# EAGLE design arduino_motor_shield2 (EAGLE 5.07)
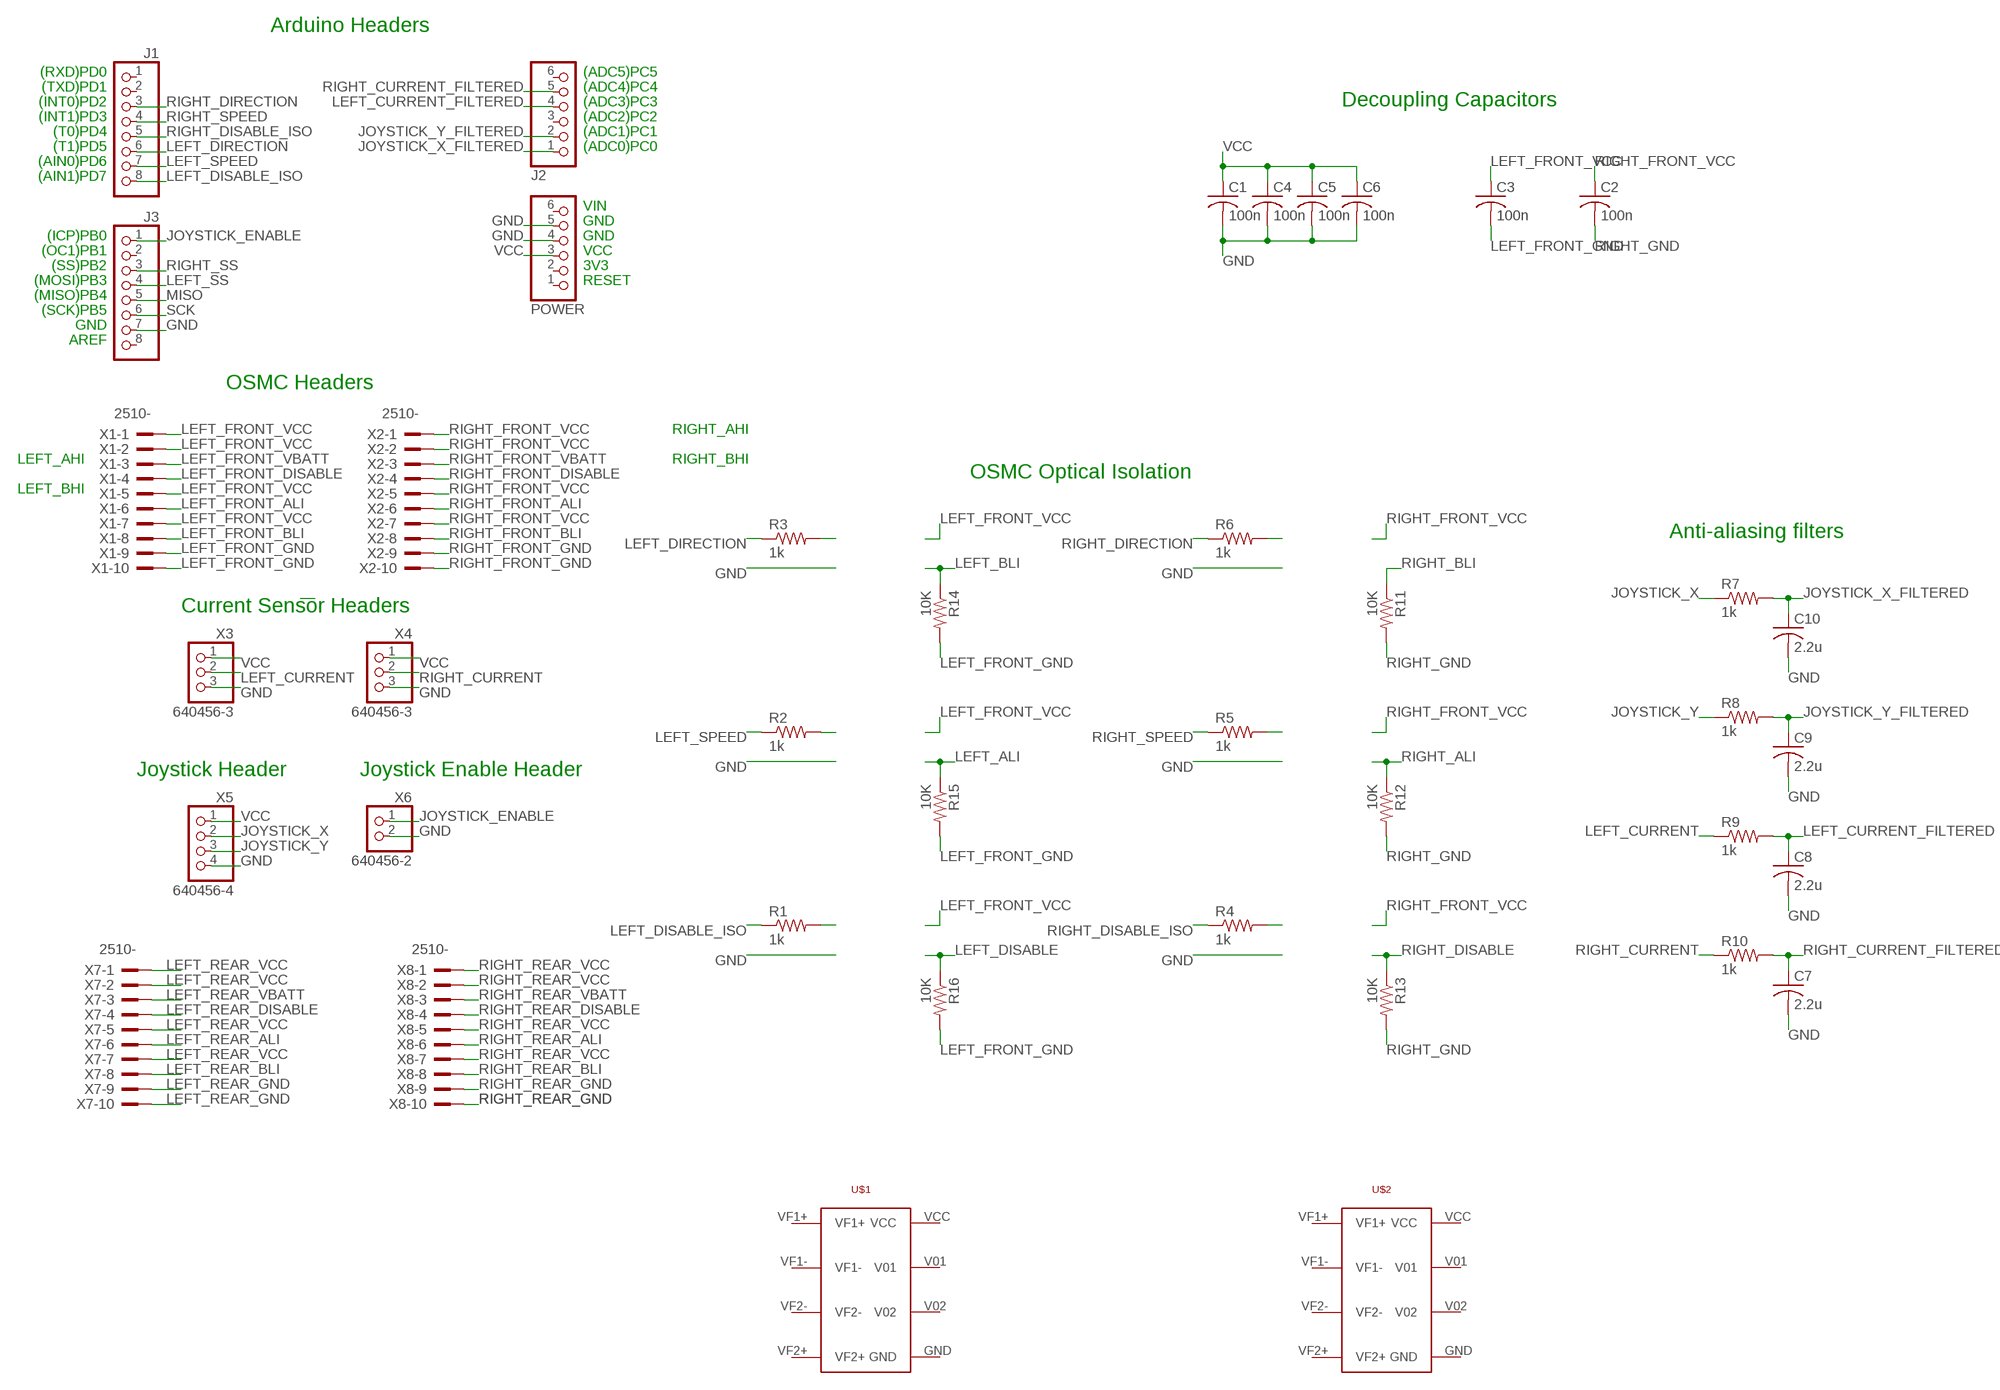
[diagram p0: schematic, sheet 1]

## Parts
C1  100n  C-USC0603  [C0603]
C2  100n  C-USC0603  [C0603]
C3  100n  C-USC0603  [C0603]
C4  100n  C-USC0603  [C0603]
C5  100n  C-USC0603  [C0603]
C6  100n  C-USC0603  [C0603]
C7  2.2u  C-USC0603  [C0603]
C8  2.2u  C-USC0603  [C0603]
C9  2.2u  C-USC0603  [C0603]
C10  2.2u  C-USC0603  [C0603]
J1  PINHD-1X8  [1X08]
J2  PINHD-1X6  [1X06]
J3  PINHD-1X8  [1X08]
POWER  PINHD-1X6  [1X06]
R1  1k  R-US_R0603  [R0603]
R2  1k  R-US_R0603  [R0603]
R3  1k  R-US_R0603  [R0603]
R4  1k  R-US_R0603  [R0603]
R5  1k  R-US_R0603  [R0603]
R6  1k  R-US_R0603  [R0603]
R7  1k  R-US_R0603  [R0603]
R8  1k  R-US_R0603  [R0603]
R9  1k  R-US_R0603  [R0603]
R10  1k  R-US_R0603  [R0603]
R11  10K  R-US_R0603  [R0603]
R12  10K  R-US_R0603  [R0603]
R13  10K  R-US_R0603  [R0603]
R14  10K  R-US_R0603  [R0603]
R15  10K  R-US_R0603  [R0603]
R16  10K  R-US_R0603  [R0603]
U$1  HCPL0611  [HCPL0611]
U$2  HCPL0611  [HCPL0611]
X1  2510-  [PAK100/2500-10]
X2  2510-  [PAK100/2500-10]
X3  640456-3  [22-23-2031]
X4  640456-3  [22-23-2031]
X5  640456-4  [22-23-2041]
X6  640456-2  [22-23-2021]
X7  2510-  [PAK100/2500-10]
X8  2510-  [PAK100/2500-10]

## Nets
GND: C1.2 C4.2 C5.2 C6.2 C7.2 C8.2 C9.2 C10.2 J3.7 POWER.4 POWER.5 X3.3 X4.3 X5.4 X6.2
JOYSTICK_ENABLE: J3.1 X6.1
JOYSTICK_X: R7.1 X5.2
JOYSTICK_X_FILTERED: C10.1 J2.1 R7.2
JOYSTICK_Y: R8.1 X5.3
JOYSTICK_Y_FILTERED: C9.1 J2.2 R8.2
LEFT_ALI: R15.1
LEFT_BLI: R14.1
LEFT_CURRENT: R9.1 X3.2
LEFT_CURRENT_FILTERED: C8.1 J2.4 R9.2
LEFT_DIRECTION: J1.6 R3.1
LEFT_DISABLE: R16.1
LEFT_DISABLE_ISO: J1.8 R1.1
LEFT_FRONT_ALI: X1.6
LEFT_FRONT_BLI: X1.8
LEFT_FRONT_DISABLE: X1.4
LEFT_FRONT_GND: C3.2 R14.2 R15.2 R16.2 X1.9 X1.10
LEFT_FRONT_VBATT: X1.3
LEFT_FRONT_VCC: C3.1 X1.1 X1.2 X1.5 X1.7
LEFT_REAR_ALI: X7.6
LEFT_REAR_BLI: X7.8
LEFT_REAR_DISABLE: X7.4
LEFT_REAR_GND: X7.9 X7.10
LEFT_REAR_VBATT: X7.3
LEFT_REAR_VCC: X7.1 X7.2 X7.5 X7.7
LEFT_SPEED: J1.7 R2.1
LEFT_SS: J3.4
MISO: J3.5
N$3: R2.2
N$8: R3.2
N$11: R6.2
N$14: R4.2
N$17: R1.2
N$20: R5.2
RIGHT_ALI: R12.1
RIGHT_BLI: R11.1
RIGHT_CURRENT: R10.1 X4.2
RIGHT_CURRENT_FILTERED: C7.1 J2.5 R10.2
RIGHT_DIRECTION: J1.3 R6.1
RIGHT_DISABLE: R13.1
RIGHT_DISABLE_ISO: J1.5 R4.1
RIGHT_FRONT_ALI: X2.6
RIGHT_FRONT_BLI: X2.8
RIGHT_FRONT_DISABLE: X2.4
RIGHT_FRONT_GND: X2.9 X2.10
RIGHT_FRONT_VBATT: X2.3
RIGHT_FRONT_VCC: C2.1 X2.1 X2.2 X2.5 X2.7
RIGHT_GND: C2.2 R11.2 R12.2 R13.2
RIGHT_REAR_ALI: X8.6
RIGHT_REAR_BLI: X8.8
RIGHT_REAR_DISABLE: X8.4
RIGHT_REAR_GND: X8.9 X8.10
RIGHT_REAR_VBATT: X8.3
RIGHT_REAR_VCC: X8.1 X8.2 X8.5 X8.7
RIGHT_SPEED: J1.4 R5.1
RIGHT_SS: J3.3
SCK: J3.6
VCC: C1.1 C4.1 C5.1 C6.1 POWER.3 X3.1 X4.1 X5.1
Unconnected: J1.1 J1.2 J2.3 J2.6 J3.2 J3.8 POWER.1 POWER.2 POWER.6 U$1.GND U$1.V01 U$1.V02 U$1.VCC U$1.VF1+ U$1.VF1- U$1.VF2+ U$1.VF2- U$2.GND U$2.V01 U$2.V02 U$2.VCC U$2.VF1+ U$2.VF1- U$2.VF2+ U$2.VF2-

## Notes on the sheet
- Arduino Headers
- (RXD)PD0 | (ADC5)PC5
- (TXD)PD1 | (ADC4)PC4
- (INT0)PD2 | (ADC3)PC3 | Decoupling Capacitors
- (INT1)PD3 | (ADC2)PC2
- (T0)PD4 | (ADC1)PC1
- (T1)PD5 | (ADC0)PC0
- (AIN0)PD6
- (AIN1)PD7
- VIN
- GND
- (ICP)PB0 | GND
- (OC1)PB1 | VCC
- (SS)PB2 | 3V3
- (MOSI)PB3 | RESET
- (MISO)PB4
- (SCK)PB5
- GND
- AREF
- OSMC Headers
- RIGHT_AHI
- LEFT_AHI | RIGHT_BHI
- OSMC Optical Isolation
- LEFT_BHI
- Anti-aliasing filters
- Current Sensor Headers
- Joystick Header | Joystick Enable Header

## Library data of the parts
C1-C10 = rcl:C-US: CAPACITOR, American symbol
J1 J3 = pinhead:PINHD-1X8: PIN HEADER
J2 POWER = pinhead:PINHD-1X6: PIN HEADER
R1-R16 = rcl:R-US_: RESISTOR, American symbol
U$1 U$2 = HCPL0611:HCPL0611
X1 X2 X7 X8 = con-3m:2510-: 3M (TM) Pak 100 4-Wall Header Source: 3M
X3 X4 = con-tycoelectronics:640456-3
X5 = con-tycoelectronics:640456-4
X6 = con-tycoelectronics:640456-2

## Board
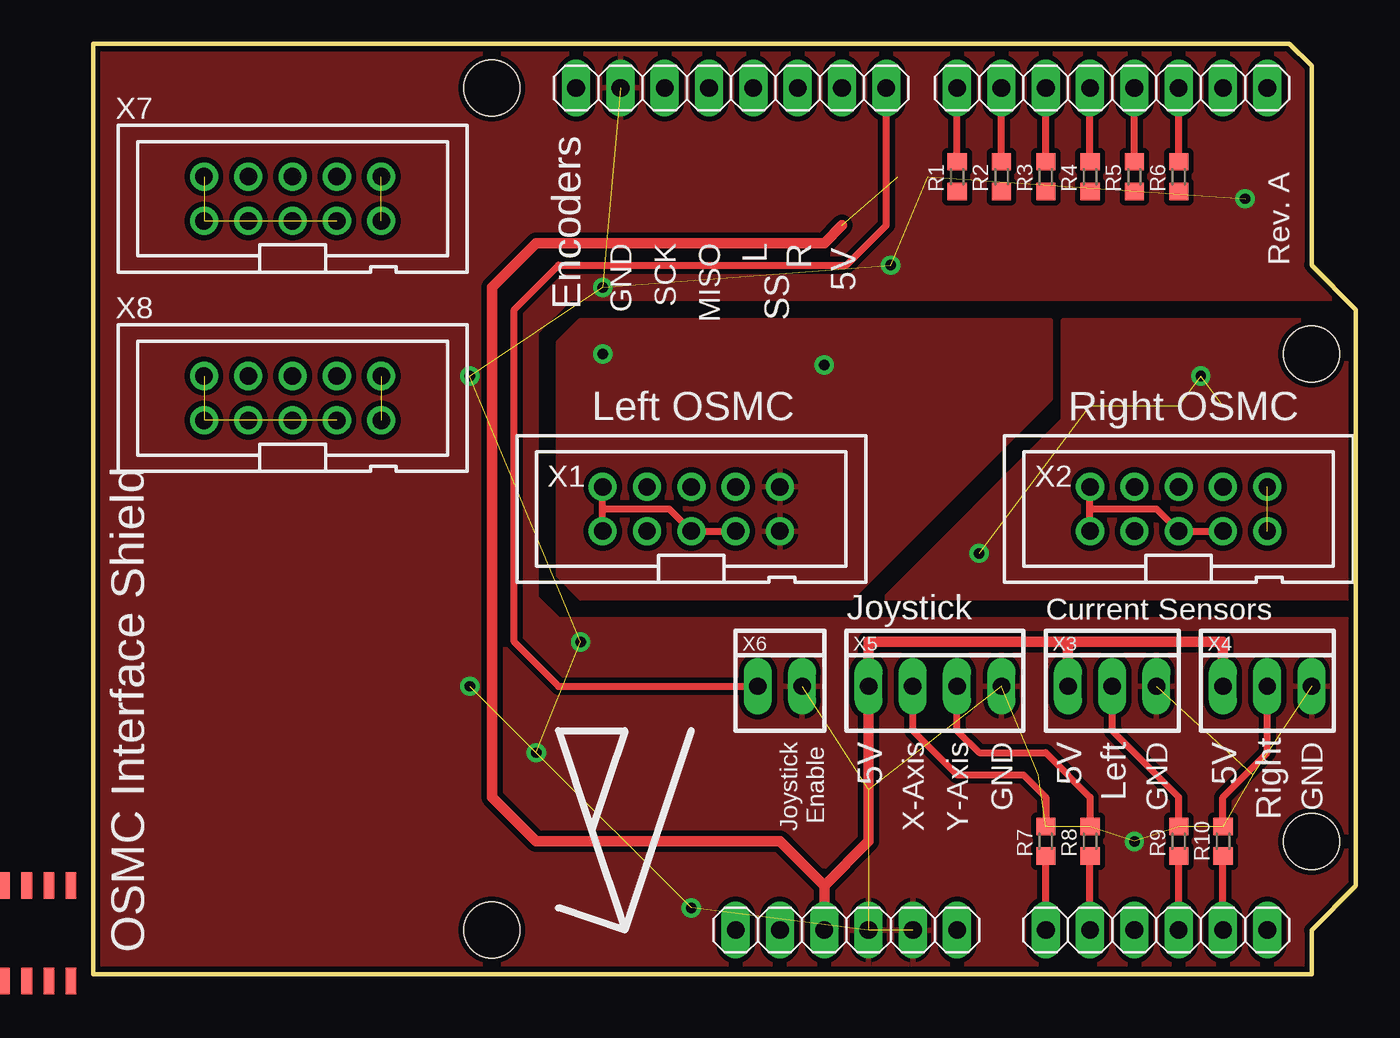
[diagram p1: board, top side]
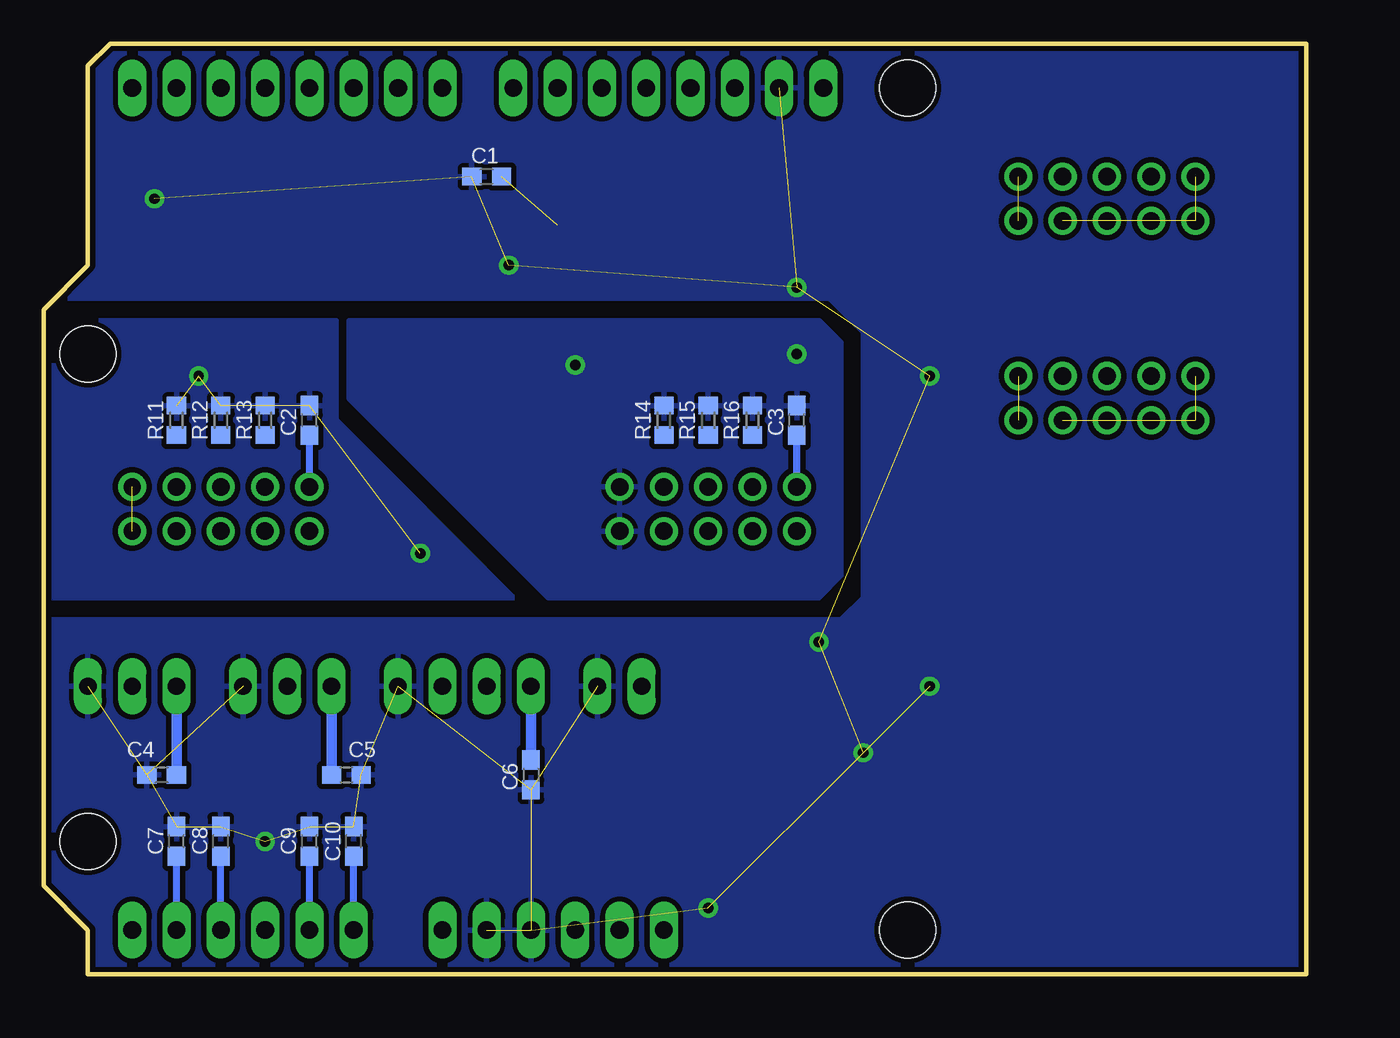
[diagram p2: board, bottom side, seen from below]

Size 72.39 x 53.34 mm. Coordinates in mm from the lower left corner, seen from the top.
Outline: 0,53.34 68.58,53.34 69.85,52.07 69.85,40.64 72.39,38.1 72.39,5.08 69.85,2.54 69.85,0 0,0 0,53.34
Copper layers (1*16): Top 0.035mm / dielectric 1.5mm / Bottom 0.035mm
Design rules "SparkFun": minimum track width 8mil, minimum drill 20mil, track to track 8mil, track to pad 8mil, pad to pad 8mil, via to via 8mil, smd to smd 8mil, copper to edge 10mil, drill to drill 8mil, minimum pad ring 12mil, minimum via ring 10mil, stop-mask expansion 4mil, vias tented up to drill 25mil, thermal gap 10mil
Holes 3.2 mm at 69.85,35.56 69.85,7.62 22.86,50.8 22.86,2.54

### Footprints (pad centres in the part's own frame; a part is rotated, then mirrored left to right if it is on the bottom)
C0603 = smd 1.1 x 1: 1 -0.85,0; 2 0.85,0
1X08 = drill 1.016 long: 1 -8.89,0; 2 -6.35,0; 3 -3.81,0; 4 -1.27,0; 5 1.27,0; 6 3.81,0; 7 6.35,0; 8 8.89,0
1X06 = drill 1.016 long: 1 -6.35,0; 2 -3.81,0; 3 -1.27,0; 4 1.27,0; 5 3.81,0; 6 6.35,0
R0603 = smd 1 x 1.1: 1 -0.85,0; 2 0.85,0
HCPL0611 = smd 0.61 x 1.524: GND 0,-5.461; V01 2.54,-5.461; V02 1.27,-5.461; VCC 3.81,-5.461; VF1+ 3.81,0; VF1- 2.54,0; VF2+ 0,0; VF2- 1.27,0
PAK100/2500-10 = drill 1 pad 1.422 round: 1 -5.08,-1.27; 2 -5.08,1.27; 3 -2.54,-1.27; 4 -2.54,1.27; 5 0,-1.27; 6 0,1.27; 7 2.54,-1.27; 8 2.54,1.27; 9 5.08,-1.27; 10 5.08,1.27
22-23-2031 = drill 1 long: 1 -2.54,0; 2 0,0; 3 2.54,0
22-23-2041 = drill 1 long: 1 -3.81,0; 2 -1.27,0; 3 1.27,0; 4 3.81,0
22-23-2021 = drill 1 long: 1 -1.27,0; 2 1.27,0

### Placement (x,y rotation side)
C1  46.99,45.72 180 bottom
C2  57.15,31.75 90 bottom
C3  29.21,31.75 90 bottom
C4  65.62,11.43 180 bottom
C5  55.03,11.43 0 bottom
C6  44.45,11.43 270 bottom
C7  64.77,7.62 90 bottom
C8  62.23,7.62 90 bottom
C9  57.15,7.62 90 bottom
C10  54.61,7.62 90 bottom
J1  58.42,50.8 180 top
J2  60.96,2.54 0 top
J3  36.58,50.8 180 top
POWER  43.18,2.54 0 top
R1  49.53,45.72 270 top
R2  52.07,45.72 270 top
R3  54.61,45.72 270 top
R4  57.15,45.72 270 top
R5  59.69,45.72 270 top
R6  62.23,45.72 270 top
R7  54.61,7.62 270 top
R8  57.15,7.62 270 top
R9  62.23,7.62 270 top
R10  64.77,7.62 270 top
R11  64.77,31.75 90 bottom
R12  62.23,31.75 90 bottom
R13  59.69,31.75 90 bottom
R14  36.83,31.75 90 bottom
R15  34.29,31.75 90 bottom
R16  31.75,31.75 90 bottom
U$1  -5.08,5.08 0 top
U$2  -11.43,5.08 0 top  (outside the outline)
X1  34.29,26.67 0 top
X2  62.23,26.67 0 top
X3  58.42,16.51 0 top
X4  67.31,16.51 0 top
X5  48.26,16.51 0 top
X6  39.37,16.51 0 top
X7  11.43,44.45 0 top
X8  11.43,33.02 0 top

### Tracks (layer width: path | path; a pad name or v marks a point on that pad's centre or on a via)
GND  (via drill 0.6)  (23 unrouted)
  other vias: 66.04,44.45 27.94,19.05 25.4,12.7 34.29,3.81 45.72,40.64 21.59,16.51 21.59,34.29 29.21,39.37 59.69,7.62
  pour Bottom (isolate 0.305): 72.39,20.32 26.67,20.32 25.4,21.59 25.4,36.83 27.3,38.73 71.75,38.73 69.85,40.64 69.85,52.07 68.58,53.34 0,53.34 0,0 69.85,0 69.85,2.54 72.39,5.08
  pour Top (isolate 0.305): 68.58,53.34 0,53.34 0,0 69.85,0 69.85,2.54 72.39,5.08 72.39,20.32 26.67,20.32 25.4,21.59 25.4,36.83 27.3,38.73 71.75,38.73 69.85,40.64 69.85,52.07
JOYSTICK_ENABLE
  Top 0.406: J3.1 45.47,42.93 43.18,40.64 26.67,40.64 24.13,38.1 24.13,19.05 26.67,16.51 X6.1
JOYSTICK_X
  Top 0.406: X5.2 46.99,13.97 49.53,11.43 53.34,11.43 54.61,10.16 R7.1
JOYSTICK_X_FILTERED
  Top 0.406: J2.1 C10.1
  Bottom 0.406: J2.1 C10.1
JOYSTICK_Y
  Top 0.406: X5.3 49.53,13.97 50.8,12.7 54.61,12.7 57.15,10.16 R8.1
JOYSTICK_Y_FILTERED
  Top 0.406: J2.2 C9.1
  Bottom 0.406: J2.2 C9.1
LEFT_CURRENT
  Top 0.406: R9.1 62.23,10.16 58.42,13.97 X3.2
LEFT_CURRENT_FILTERED
  Top 0.406: J2.4 C8.1
  Bottom 0.406: J2.4 C8.1
LEFT_DIRECTION
  Top 0.406: R3.1 J1.6
LEFT_DISABLE_ISO
  Top 0.406: R1.1 J1.8
LEFT_FRONT_GND  (via drill 0.6)
  other vias: 41.91,34.92 29.21,35.56
  pour Bottom (isolate 0.305): 54.86,37.47 54.86,33.02 43.43,21.59 27.94,21.59 26.67,22.86 26.67,36.2 27.94,37.47
  pour Top (isolate 0.305): 54.86,37.47 54.86,33.02 43.43,21.59 27.94,21.59 26.67,22.86 26.67,36.2 27.94,37.47
LEFT_FRONT_VCC
  Top 0.406: X1.7 X1.5 33.02,26.67 29.21,26.67 | X1.1 29.21,26.67 | 29.21,26.67 X1.2
  Bottom 0.406: X1.2 C3.1
LEFT_REAR_GND  (1 unrouted)
LEFT_REAR_VCC  (3 unrouted)
LEFT_SPEED
  Top 0.406: R2.1 J1.7
RIGHT_CURRENT
  Top 0.406: X4.2 67.31,12.7 64.77,10.16 R10.1
RIGHT_CURRENT_FILTERED
  Top 0.406: J2.5 C7.1
  Bottom 0.406: J2.5 C7.1
RIGHT_DIRECTION
  Top 0.406: R6.1 J1.3
RIGHT_DISABLE_ISO
  Top 0.406: R4.1 J1.5
RIGHT_FRONT_GND  (1 unrouted)
RIGHT_FRONT_VCC
  Top 0.406: X2.7 X2.5 60.96,26.67 57.15,26.67 | 57.15,26.67 X2.2 | X2.1 57.15,26.67
  Bottom 0.406: X2.2 C2.1
RIGHT_GND  (via drill 0.6)  (5 unrouted)
  other vias: 63.5,34.29 50.8,24.13
  pour Bottom (isolate 0.305): 55.63,37.47 72.39,37.47 72.39,21.59 45.47,21.59 55.63,31.75
  pour Top (isolate 0.305): 55.63,37.47 72.39,37.47 72.39,21.59 45.47,21.59 55.63,31.75
RIGHT_REAR_GND  (1 unrouted)
RIGHT_REAR_VCC  (3 unrouted)
RIGHT_SPEED
  Top 0.406: R5.1 J1.4
VCC  (1 unrouted)
  Top 0.61: 42.93,42.93 41.91,41.91 25.4,41.91 22.86,39.37 22.86,10.16 25.4,7.62 39.37,7.62 41.91,5.08 | 55.88,19.05 44.45,19.05 X5.1 44.45,7.62 41.91,5.08 | 55.88,19.05 64.77,19.05 X4.1 | 55.88,19.05 X3.1 | 41.91,5.08 POWER.3
  Bottom 0.61: X5.1 C6.1 | X3.1 C5.1 | X4.1 C4.1

### Text on the board
tPlace: GND | SCK | MISO | L | R | 5V | Rev. A | SS | Encoders | Left OSMC | Right OSMC | Joystick | Current Sensors | Right | Joystick | Enable | 5V | X-Axis | Y-Axis | GND | 5V | Left | GND | 5V | GND | OSMC Interface Shield